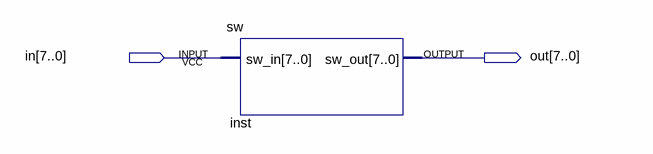
[diagram p0: schematic sheet]
// Quartus schematic sw_bdf.bdf as structural Verilog: 1 symbols, 2 pins
module sw_bdf (
  input  [7:0] in,
  output [7:0] out
);

  sw inst (.sw_in(in), .sw_out(out));
endmodule
